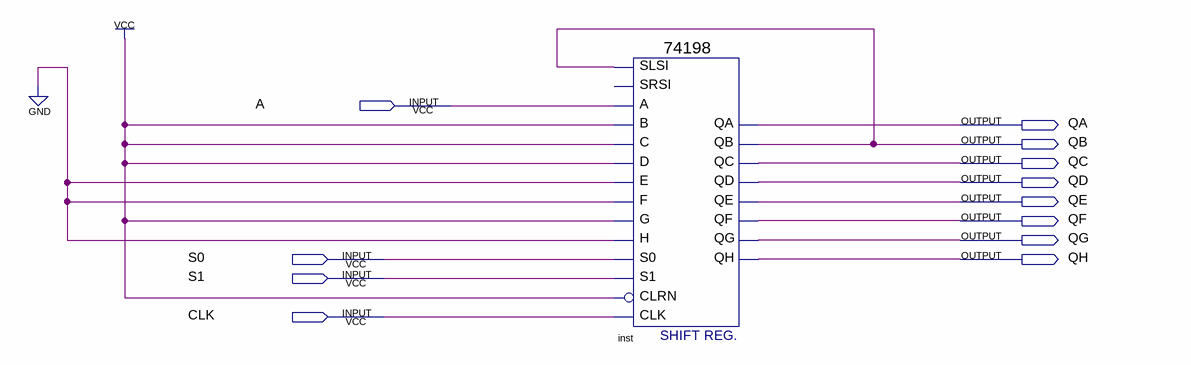
[diagram p0: schematic sheet]
// Quartus schematic for8m.bdf as structural Verilog: 1 symbols, 12 pins
module for8m (
  input  A,
  input  S0,
  input  S1,
  input  CLK,
  output QA,
  output QB,
  output QC,
  output QD,
  output QE,
  output QF,
  output QG,
  output QH
);

  \74198  inst (
    .A(A), .SLSI(QB), .E(1'b0), .S0(S0), .B(1'b1), .C(1'b1), .D(1'b1), .H(1'b0), .G(1'b1), .CLRN(1'b1),
    .CLK(CLK), .F(1'b0), .S1(S1), .QD(QD), .QC(QC), .QH(QH), .QA(QA), .QB(QB), .QE(QE), .QF(QF), .QG(QG));  // open: SRSI
endmodule
